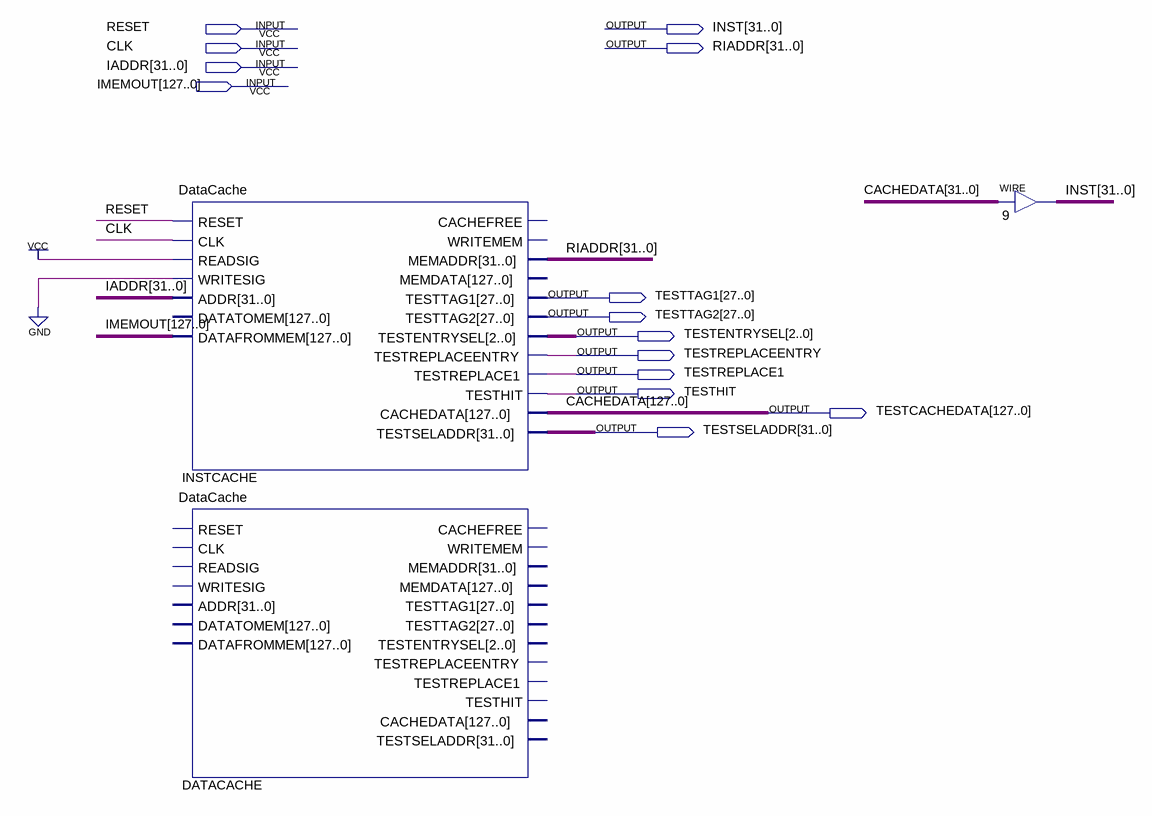
[diagram p0: schematic sheet]
// Quartus schematic Coprocessor.bdf as structural Verilog: 3 symbols, 14 pins
module Coprocessor (
  input  RESET,
  input  CLK,
  input  [31:0] IADDR,
  input  [127:0] IMEMOUT,
  output [31:0] INST,
  output [31:0] RIADDR,
  output [27:0] TESTTAG1,
  output [27:0] TESTTAG2,
  output [2:0] TESTENTRYSEL,
  output TESTREPLACEENTRY,
  output TESTREPLACE1,
  output TESTHIT,
  output [127:0] TESTCACHEDATA,
  output [31:0] TESTSELADDR
);

  DataCache INSTCACHE (
    .RESET(RESET), .CLK(CLK), .READSIG(1'b1), .WRITESIG(1'b0), .ADDR(IADDR), .DATAFROMMEM(IMEMOUT),
    .MEMADDR(RIADDR), .TESTTAG1(TESTTAG1), .TESTTAG2(TESTTAG2), .TESTENTRYSEL(TESTENTRYSEL),
    .TESTREPLACEENTRY(TESTREPLACEENTRY), .TESTREPLACE1(TESTREPLACE1), .TESTHIT(TESTHIT),
    .CACHEDATA(TESTCACHEDATA), .TESTSELADDR(TESTSELADDR));  // open: DATATOMEM, CACHEFREE, WRITEMEM, MEMDATA
  DataCache DATACACHE ();  // open: RESET, CLK, READSIG, WRITESIG, ADDR, DATATOMEM, DATAFROMMEM, CACHEFREE, WRITEMEM, MEMADDR, MEMDATA, TESTTAG1, TESTTAG2, TESTENTRYSEL, TESTREPLACEENTRY, TESTREPLACE1, TESTHIT, CACHEDATA, TESTSELADDR
  assign INST = TESTCACHEDATA[31:0];  // WIRE 9

  // Other names for the same wires on the sheet: CACHEDATA[127:0] = TESTCACHEDATA
endmodule
